# EAGLE design main (EAGLE 5.11)

## Sheet 1 of 5
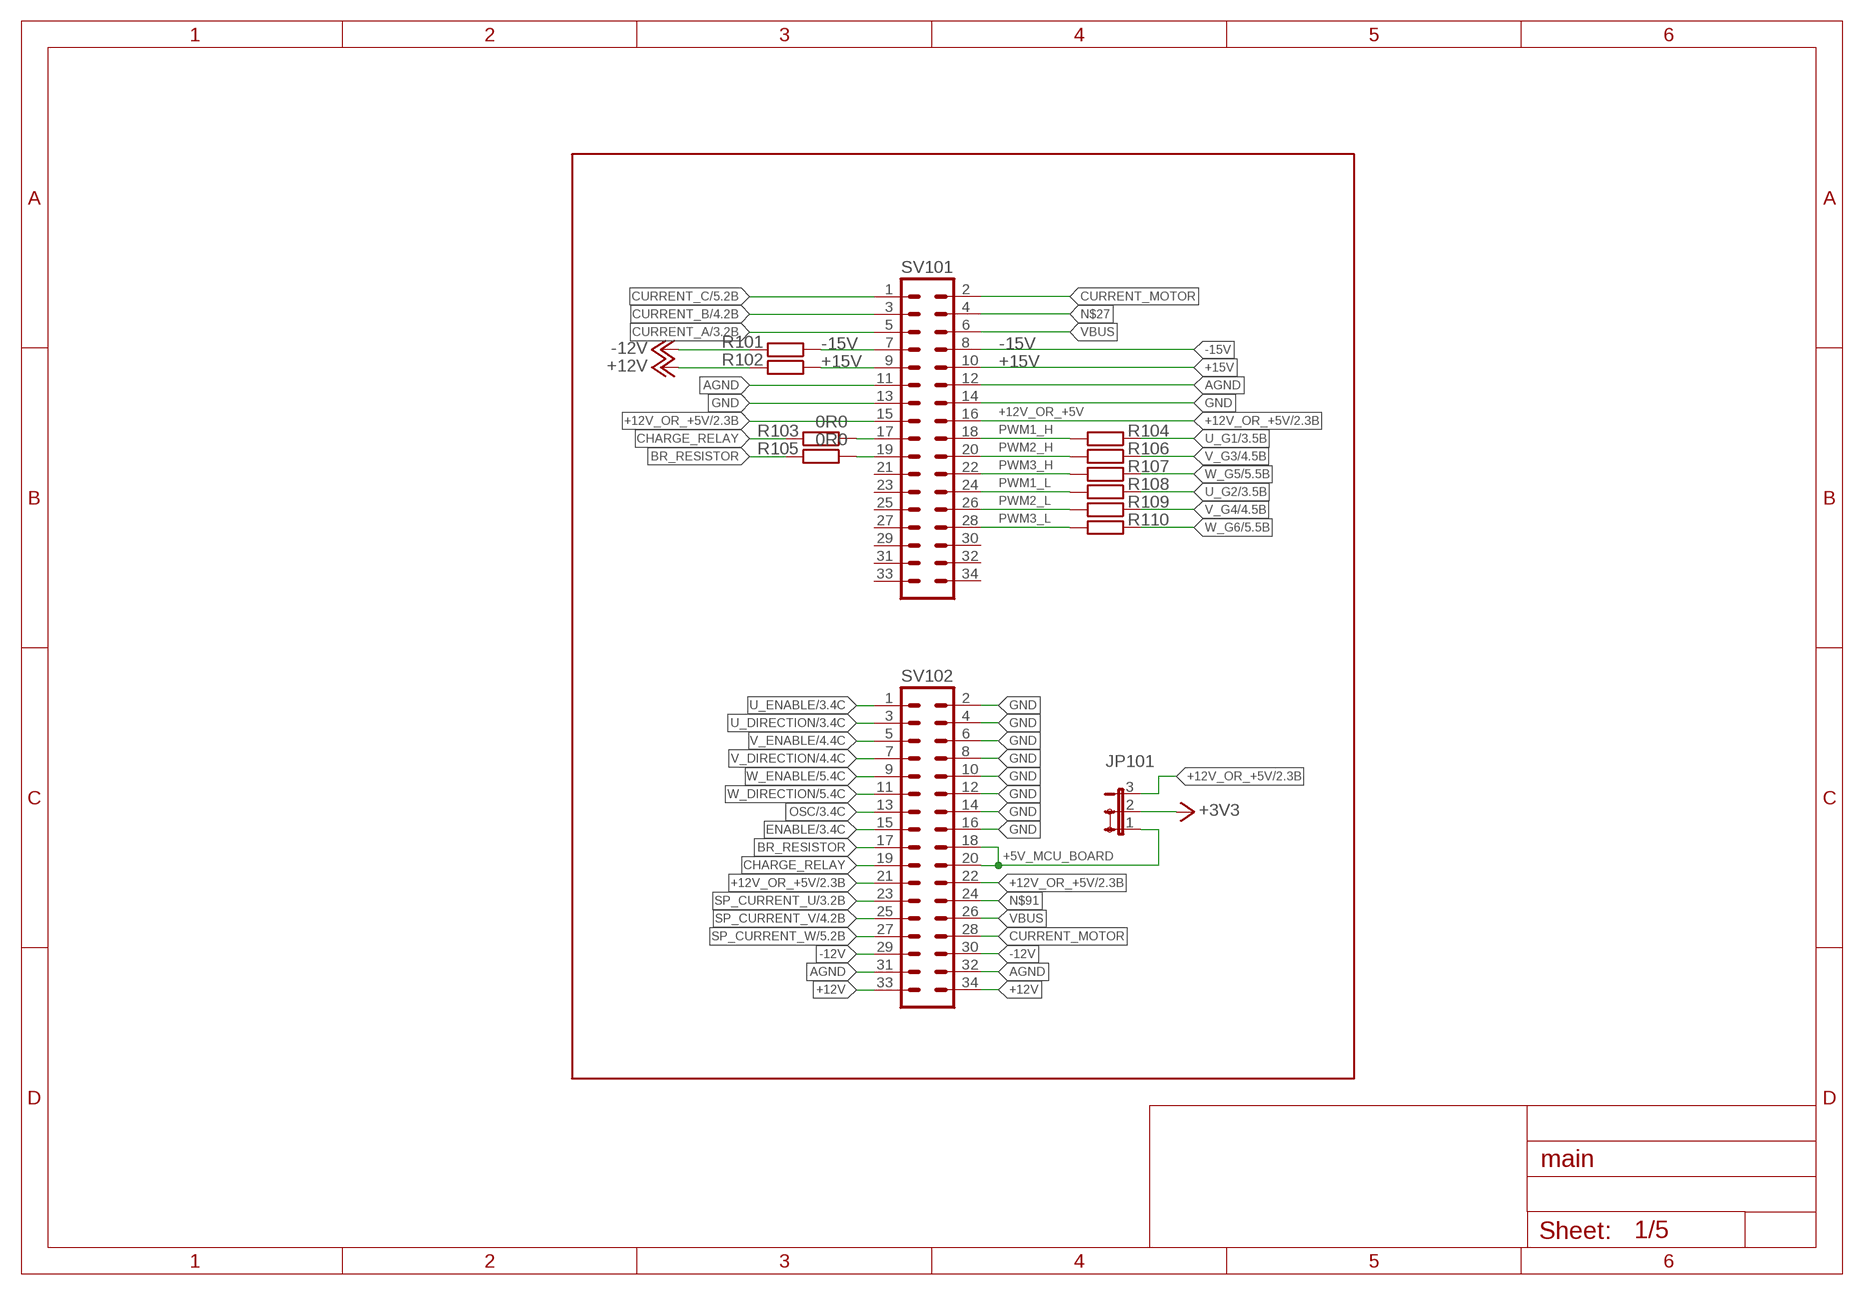
[diagram p0: schematic, sheet 1]

### Parts
JP101  JP2E  [JP2]
R101  R-EU_0204/7  [0204/7]
R102  R-EU_0204/7  [0204/7]
R103  0R0  R-EU_0204/7  [0204/7]
R104  R-EU_0204/7  [0204/7]
R105  0R0  R-EU_0204/7  [0204/7]
R106  R-EU_0204/7  [0204/7]
R107  R-EU_0204/7  [0204/7]
R108  R-EU_0204/7  [0204/7]
R109  R-EU_0204/7  [0204/7]
R110  R-EU_0204/7  [0204/7]
SV101  ML34  [ML34]
SV102  ML34  [ML34]

### Nets
+3V3: JP101.2 ; also sheet 2,3,4,5
+5V_MCU_BOARD: JP101.1 SV102.18 SV102.20
+12V: R102.2 SV102.33 SV102.34 ; also sheet 3,4,5
+12V_OR_+5V: JP101.3 SV101.15 SV101.16 SV102.21 SV102.22 ; also sheet 2
+15V: R102.1 SV101.9 SV101.10
-12V: R101.2 SV102.29 SV102.30 ; also sheet 3,4,5
-15V: R101.1 SV101.7 SV101.8
AGND: SV101.11 SV101.12 SV102.31 SV102.32 ; also sheet 3,4,5
BR_RESISTOR: R105.2 SV102.17
CHARGE_RELAY: R103.2 SV102.19
CURRENT_A: SV101.5 ; also sheet 3
CURRENT_B: SV101.3 ; also sheet 4
CURRENT_C: SV101.1 ; also sheet 5
CURRENT_MOTOR: SV101.2 SV102.28
ENABLE: SV102.15 ; also sheet 3,4,5
GND: SV101.13 SV101.14 SV102.2 SV102.4 SV102.6 SV102.8 SV102.10 SV102.12 SV102.14 SV102.16 ; also sheet 2,3,4,5
N$8: R105.1 SV101.19
N$27: SV101.4
N$41: R103.1 SV101.17
N$91: SV102.24
OSC: SV102.13 ; also sheet 3,4,5
PWM1_H: R104.2 SV101.18
PWM1_L: R108.2 SV101.24
PWM2_H: R106.2 SV101.20
PWM2_L: R109.2 SV101.26
PWM3_H: R107.2 SV101.22
PWM3_L: R110.2 SV101.28
SP_CURRENT_U: SV102.23 ; also sheet 3
SP_CURRENT_V: SV102.25 ; also sheet 4
SP_CURRENT_W: SV102.27 ; also sheet 5
U_DIRECTION: SV102.3 ; also sheet 3
U_ENABLE: SV102.1 ; also sheet 3
U_G1: R104.1 ; also sheet 3
U_G2: R108.1 ; also sheet 3
V_DIRECTION: SV102.7 ; also sheet 4
V_ENABLE: SV102.5 ; also sheet 4
V_G3: R106.1 ; also sheet 4
V_G4: R109.1 ; also sheet 4
VBUS: SV101.6 SV102.26
W_DIRECTION: SV102.11 ; also sheet 5
W_ENABLE: SV102.9 ; also sheet 5
W_G5: R107.1 ; also sheet 5
W_G6: R110.1 ; also sheet 5
Unconnected: SV101.21 SV101.23 SV101.25 SV101.27 SV101.29 SV101.30 SV101.31 SV101.32 SV101.33 SV101.34

## Sheet 2 of 5
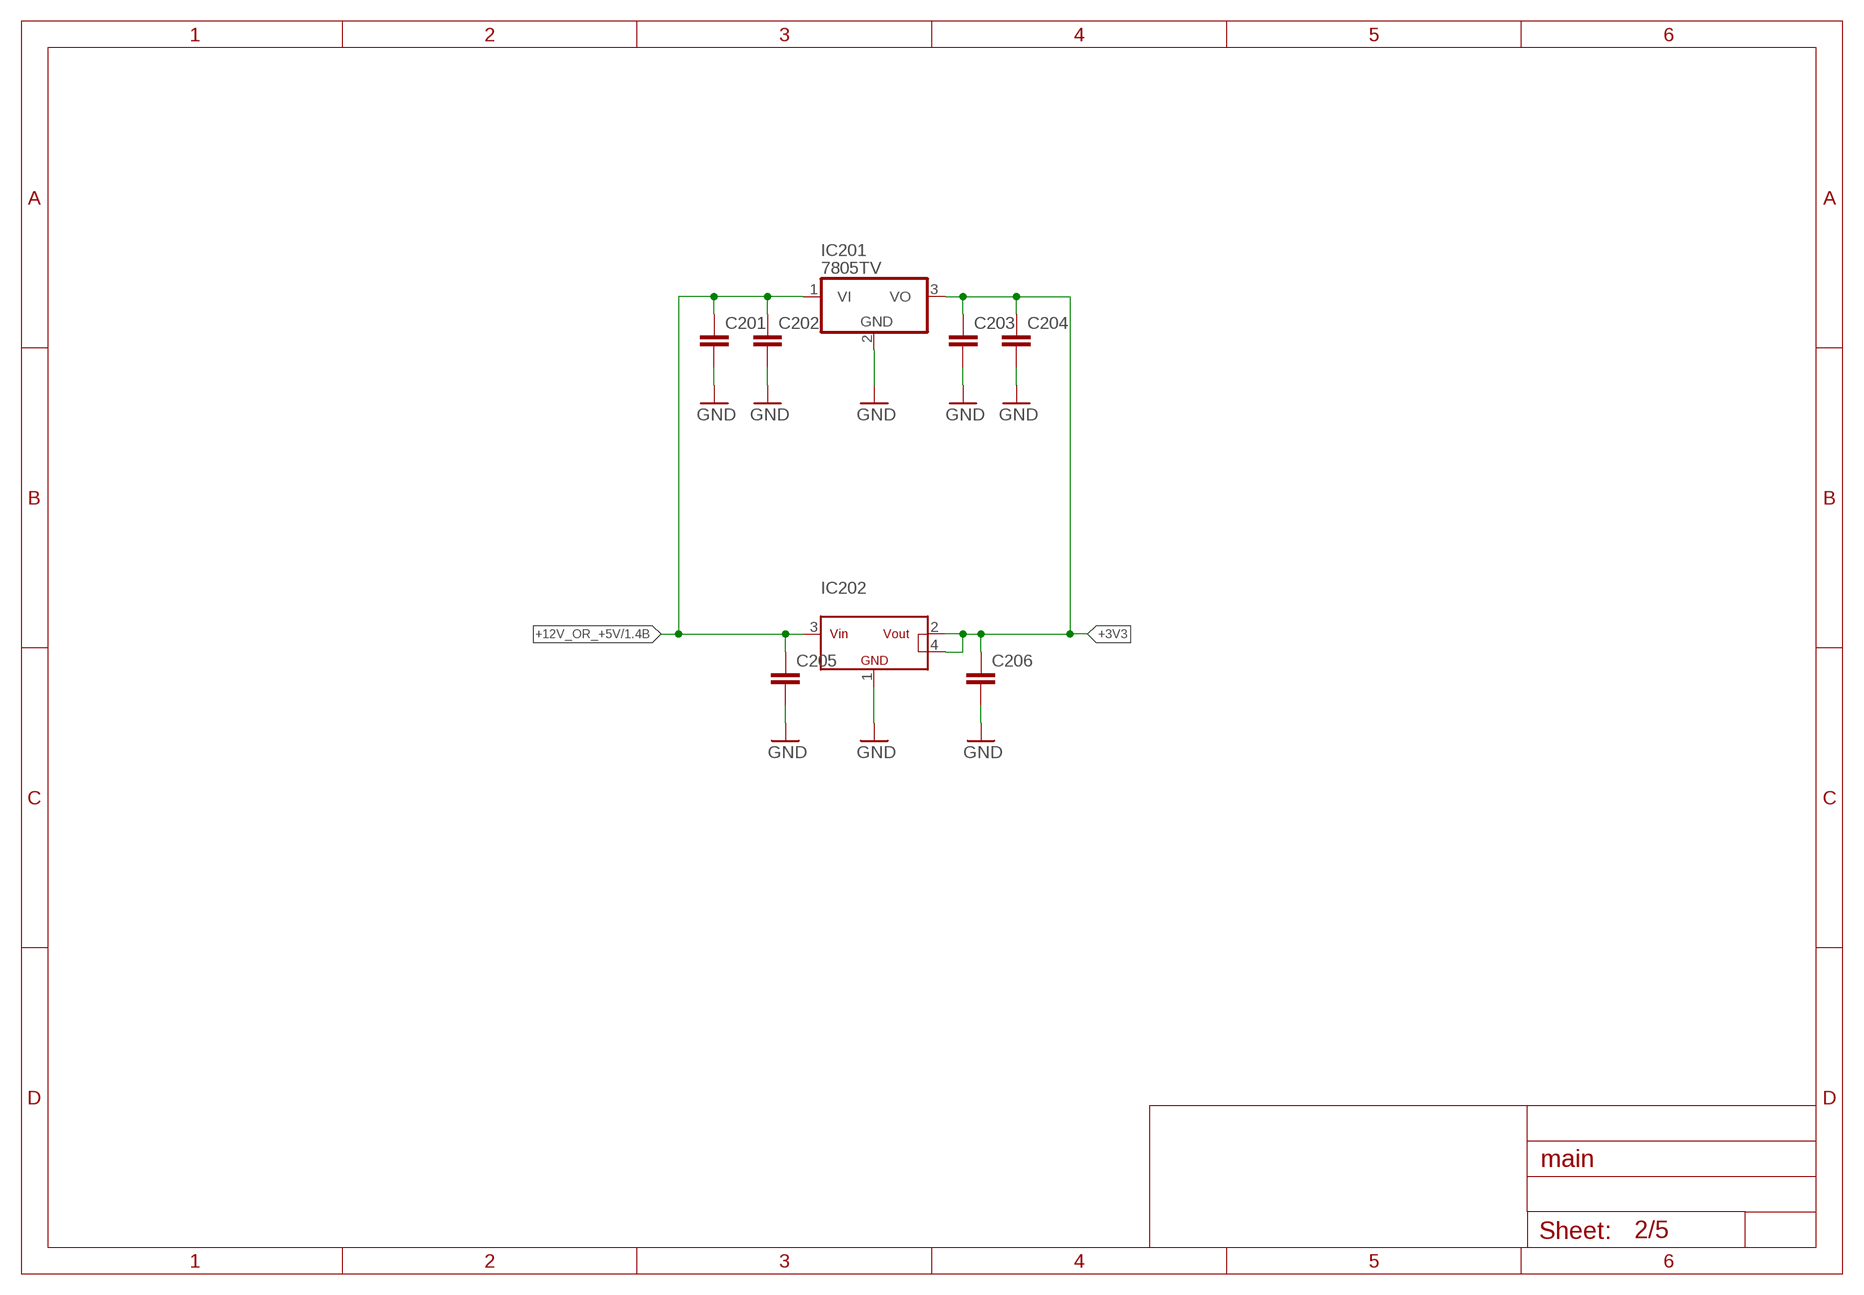
[diagram p1: schematic, sheet 2]

### Parts
C201  C-EUC1206  [C1206]
C202  C-EUC1206  [C1206]
C203  C-EUC1206  [C1206]
C204  C-EUC1206  [C1206]
C205  C-EUC1206  [C1206]
C206  C-EUC1206  [C1206]
IC201  7805TV  [TO220V]
IC202  LM317_SOT223  [SOT223]

### Nets
+3V3: C203.1 C204.1 C206.1 IC201.3(VO) IC202.2 IC202.4(TAB) ; also sheet 1,3,4,5
+12V_OR_+5V: C201.1 C202.1 C205.1 IC201.1(VI) IC202.3 ; also sheet 1
GND: C201.2 C202.2 C203.2 C204.2 C205.2 C206.2 IC201.2(GND) IC202.1 ; also sheet 1,3,4,5

## Sheet 3 of 5
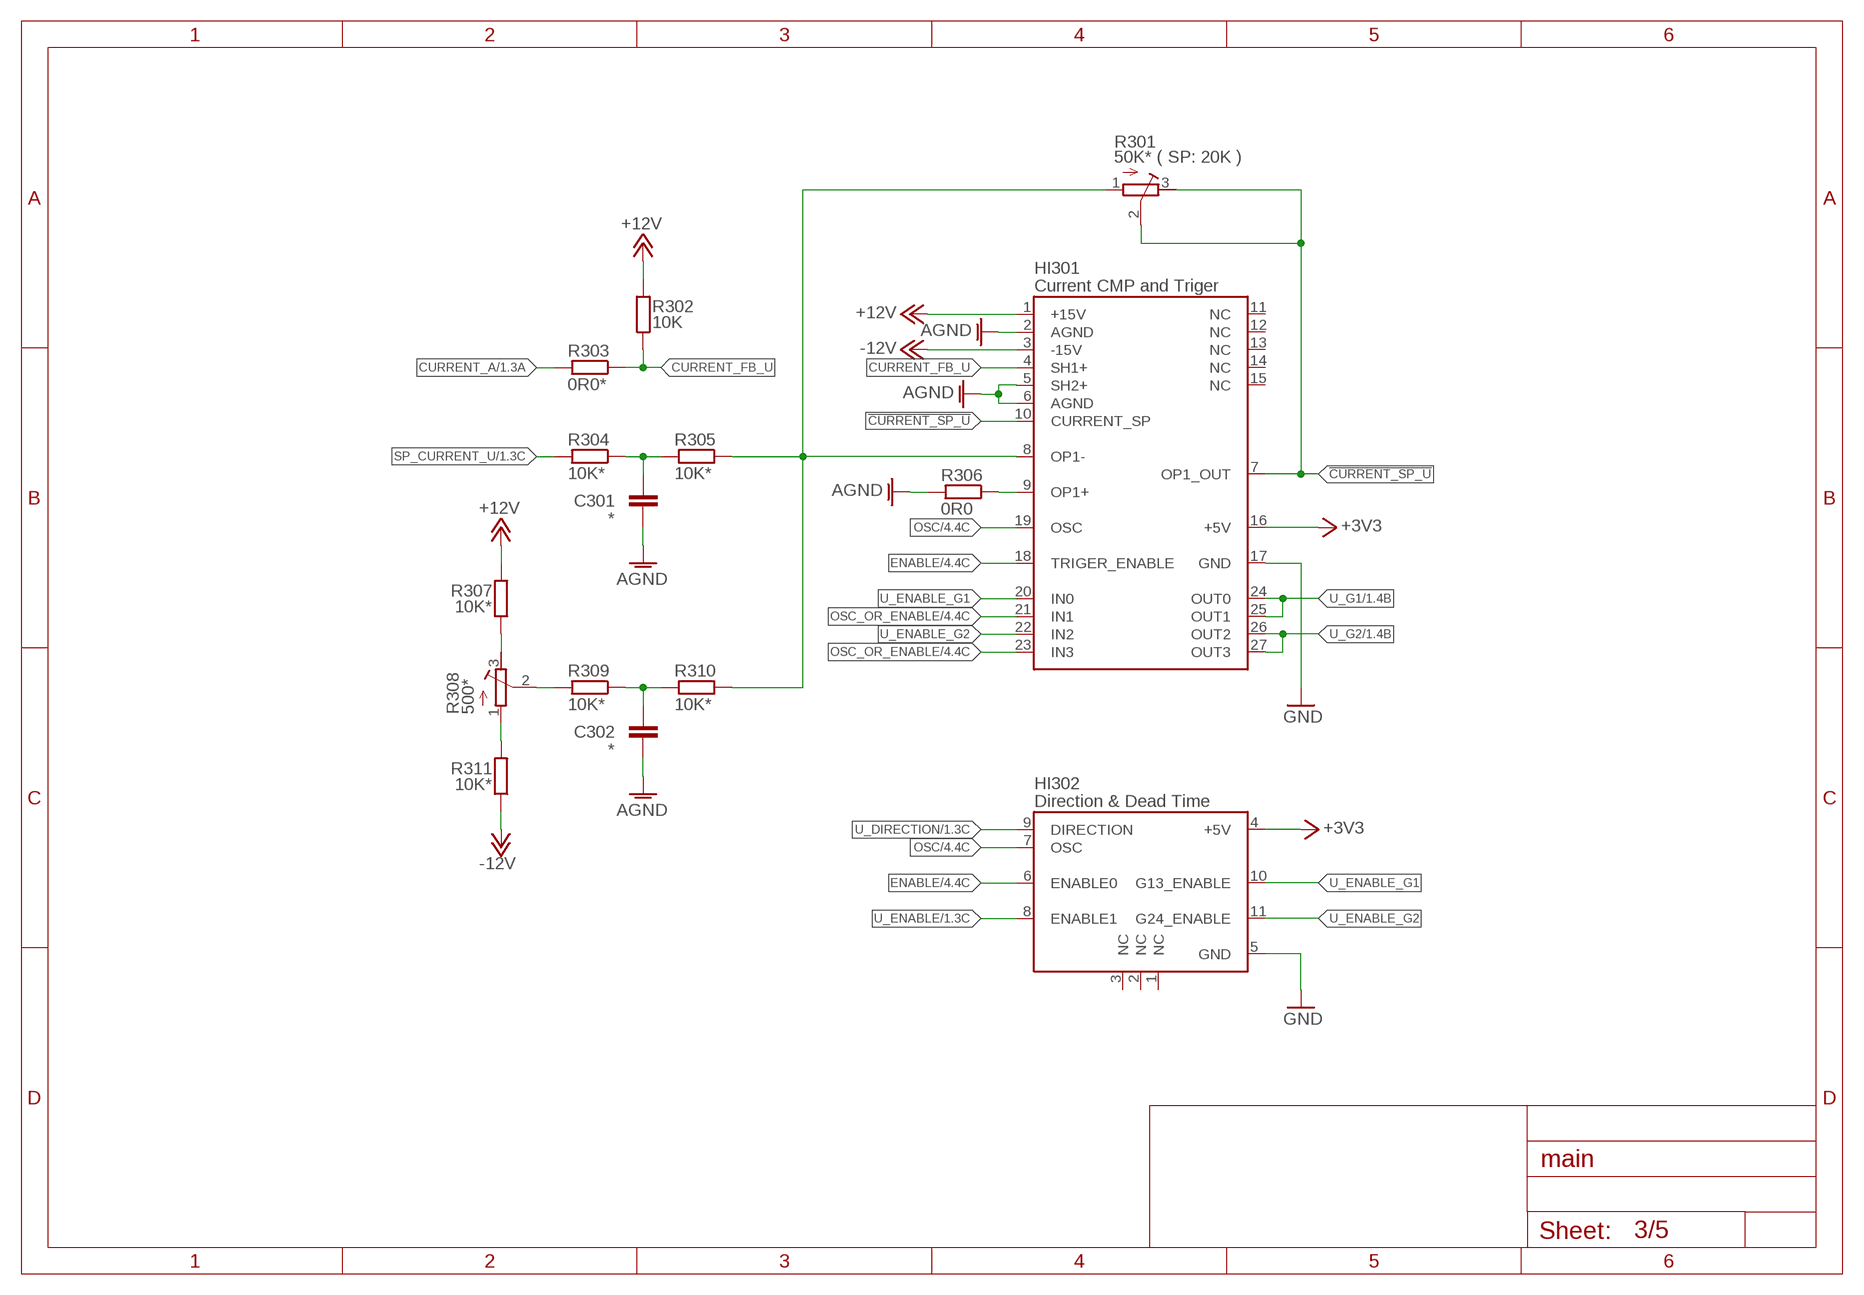
[diagram p2: schematic, sheet 3]

### Parts
C301  *  C-EU050-030X075  [C050-030X075]
C302  *  C-EU050-030X075  [C050-030X075]
HI301  Current CMP and Triger  19.05.15  [19.06.15_H]
HI302  Direction & Dead Time  19.05.15  [19.06.15_H]
R301  50K* ( SP: 20K )  R-TRIMM3296W  [RTRIM3296W]
R302  10K  R-EU_0204/7  [0204/7]
R303  0R0*  R-EU_0204/7  [0204/7]
R304  10K*  R-EU_0204/7  [0204/7]
R305  10K*  R-EU_0204/7  [0204/7]
R306  0R0  R-EU_0204/7  [0204/7]
R307  10K*  R-EU_0204/7  [0204/7]
R308  500*  R-TRIMM3296W  [RTRIM3296W]
R309  10K*  R-EU_0204/7  [0204/7]
R310  10K*  R-EU_0204/7  [0204/7]
R311  10K*  R-EU_0204/7  [0204/7]

### Nets
!CURRENT_SP_U: HI301.7(OP1_OUT) HI301.10(CURRENT_SP) R301.2(S) R301.3(A)
+3V3: HI301.16(+5V) HI302.4(+5V) ; also sheet 1,2,4,5
+12V: HI301.1(+15V) R302.2 R307.2 ; also sheet 1,4,5
-12V: HI301.3(-15V) R311.1 ; also sheet 1,4,5
AGND: C301.2 C302.2 HI301.2(AGND) HI301.5(SH2+) HI301.6(AGND) R306.2 ; also sheet 1,4,5
CURRENT_A: R303.2 ; also sheet 1
CURRENT_FB_U: HI301.4(SH1+) R302.1 R303.1
ENABLE: HI301.18(TRIGER_ENABLE) HI302.6(ENABLE0) ; also sheet 1,4,5
GND: HI301.17(GND) HI302.5(GND) ; also sheet 1,2,4,5
N$55: HI301.8(OP1-) R301.1(E) R305.1 R310.1
N$56: C301.1 R304.1 R305.2
N$57: HI301.9(OP1+) R306.1
N$58: C302.1 R309.1 R310.2
N$59: R308.2(S) R309.2
N$60: R307.1 R308.3(A)
N$61: R308.1(E) R311.2
OSC: HI301.19(OSC) HI302.7(OSC) ; also sheet 1,4,5
OSC_OR_ENABLE: HI301.21(IN1) HI301.23(IN3) ; also sheet 4,5
SP_CURRENT_U: R304.2 ; also sheet 1
U_DIRECTION: HI302.9(DIRECTION) ; also sheet 1
U_ENABLE: HI302.8(ENABLE1) ; also sheet 1
U_ENABLE_G1: HI301.20(IN0) HI302.10(G13_ENABLE)
U_ENABLE_G2: HI301.22(IN2) HI302.11(G24_ENABLE)
U_G1: HI301.24(OUT0) HI301.25(OUT1) ; also sheet 1
U_G2: HI301.26(OUT2) HI301.27(OUT3) ; also sheet 1
Unconnected: HI301.11(NC) HI301.12(NC) HI301.13(NC) HI301.14(NC) HI301.15(NC) HI302.1(NC) HI302.2(NC) HI302.3(NC)

## Sheet 4 of 5
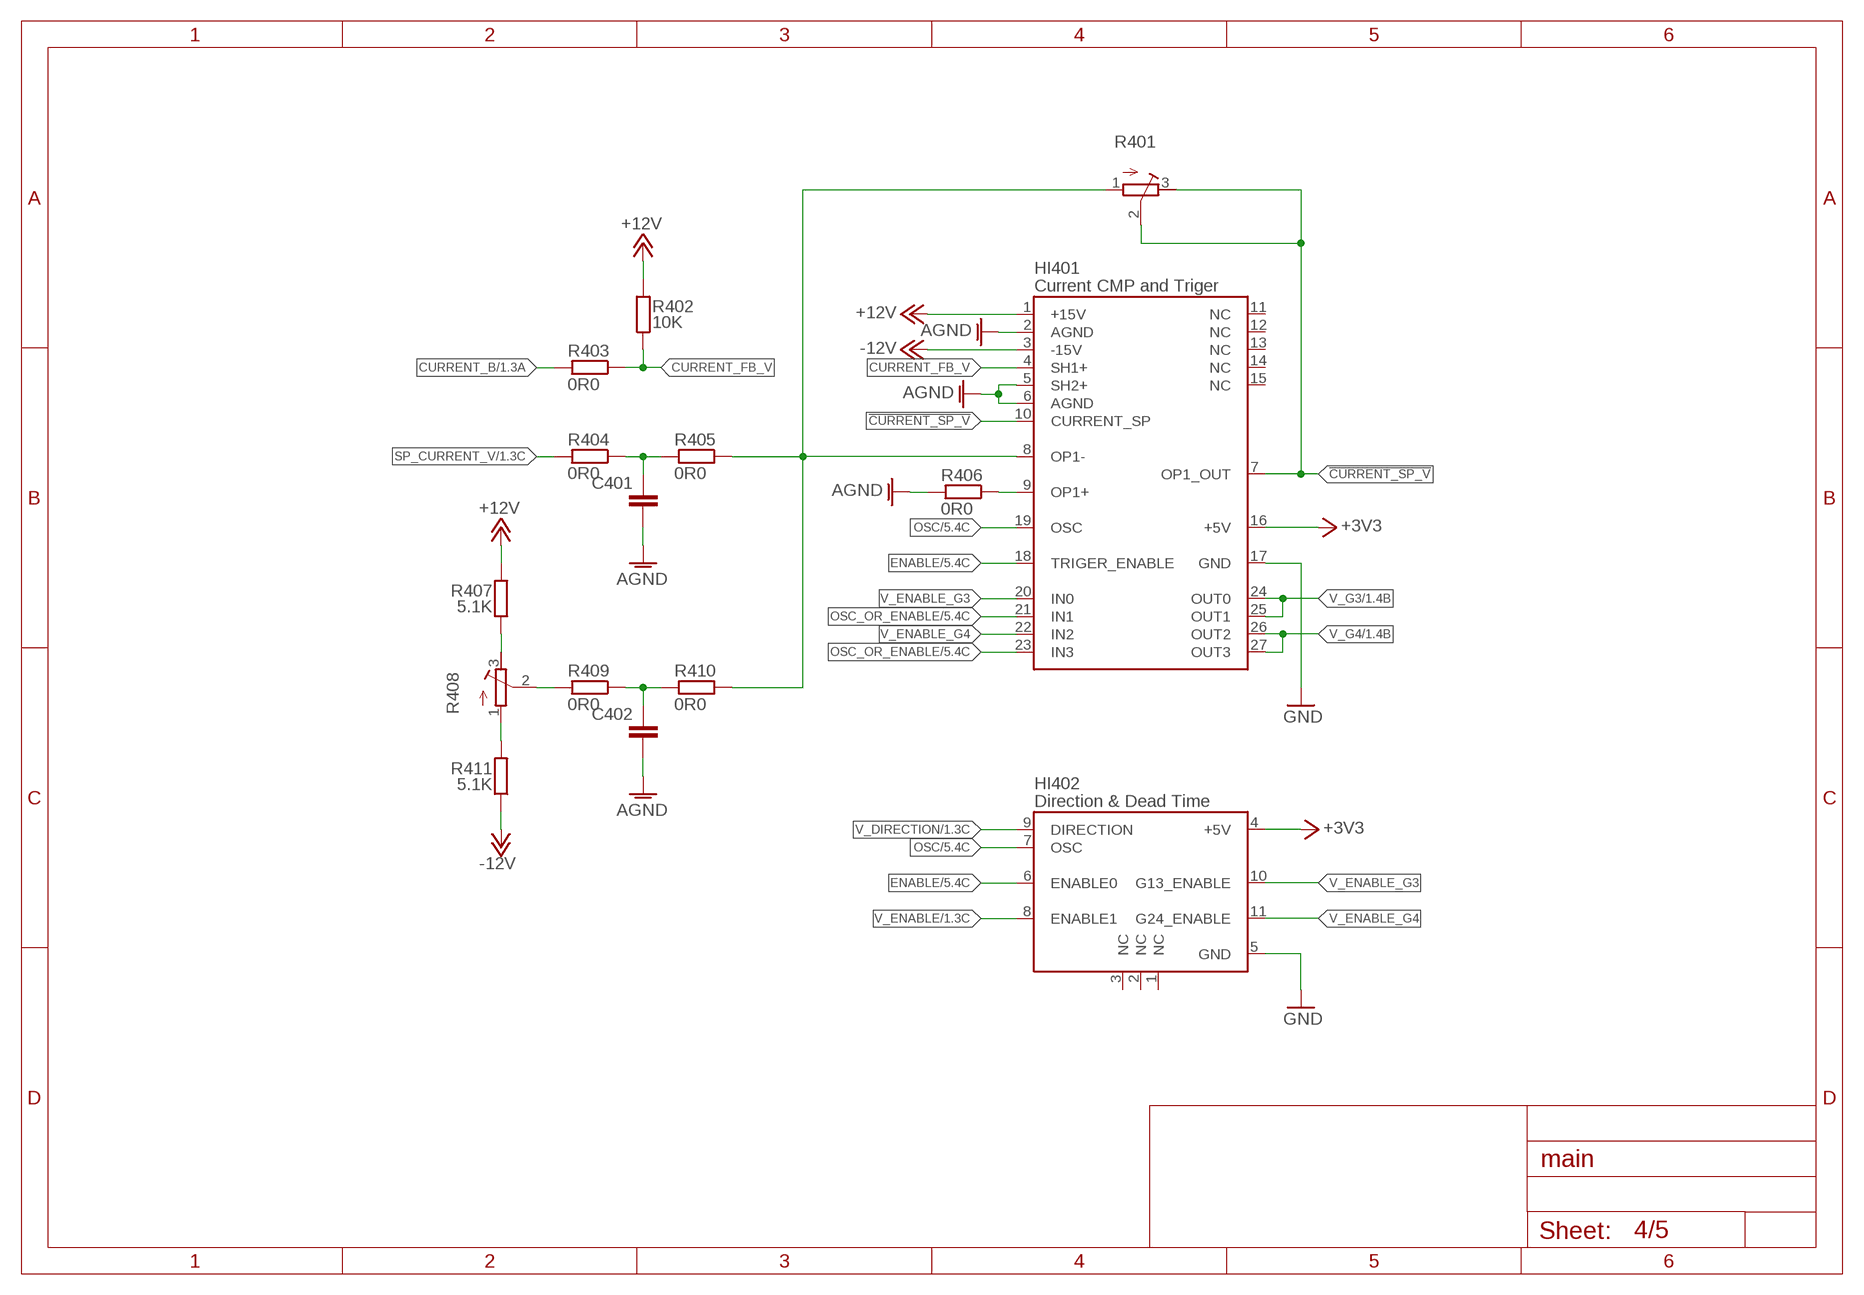
[diagram p3: schematic, sheet 4]

### Parts
C401  C-EU050-030X075  [C050-030X075]
C402  C-EU050-030X075  [C050-030X075]
HI401  Current CMP and Triger  19.05.15  [19.06.15_H]
HI402  Direction & Dead Time  19.05.15  [19.06.15_H]
R401  R-TRIMM3296W  [RTRIM3296W]
R402  10K  R-EU_0204/7  [0204/7]
R403  0R0  R-EU_0204/7  [0204/7]
R404  0R0  R-EU_0204/7  [0204/7]
R405  0R0  R-EU_0204/7  [0204/7]
R406  0R0  R-EU_0204/7  [0204/7]
R407  5.1K  R-EU_0204/7  [0204/7]
R408  R-TRIMM3296W  [RTRIM3296W]
R409  0R0  R-EU_0204/7  [0204/7]
R410  0R0  R-EU_0204/7  [0204/7]
R411  5.1K  R-EU_0204/7  [0204/7]

### Nets
!CURRENT_SP_V: HI401.7(OP1_OUT) HI401.10(CURRENT_SP) R401.2(S) R401.3(A)
+3V3: HI401.16(+5V) HI402.4(+5V) ; also sheet 1,2,3,5
+12V: HI401.1(+15V) R402.2 R407.2 ; also sheet 1,3,5
-12V: HI401.3(-15V) R411.1 ; also sheet 1,3,5
AGND: C401.2 C402.2 HI401.2(AGND) HI401.5(SH2+) HI401.6(AGND) R406.2 ; also sheet 1,3,5
CURRENT_B: R403.2 ; also sheet 1
CURRENT_FB_V: HI401.4(SH1+) R402.1 R403.1
ENABLE: HI401.18(TRIGER_ENABLE) HI402.6(ENABLE0) ; also sheet 1,3,5
GND: HI401.17(GND) HI402.5(GND) ; also sheet 1,2,3,5
N$62: HI401.8(OP1-) R401.1(E) R405.1 R410.1
N$63: C401.1 R404.1 R405.2
N$64: HI401.9(OP1+) R406.1
N$65: C402.1 R409.1 R410.2
N$66: R408.2(S) R409.2
N$67: R407.1 R408.3(A)
N$68: R408.1(E) R411.2
OSC: HI401.19(OSC) HI402.7(OSC) ; also sheet 1,3,5
OSC_OR_ENABLE: HI401.21(IN1) HI401.23(IN3) ; also sheet 3,5
SP_CURRENT_V: R404.2 ; also sheet 1
V_DIRECTION: HI402.9(DIRECTION) ; also sheet 1
V_ENABLE: HI402.8(ENABLE1) ; also sheet 1
V_ENABLE_G3: HI401.20(IN0) HI402.10(G13_ENABLE)
V_ENABLE_G4: HI401.22(IN2) HI402.11(G24_ENABLE)
V_G3: HI401.24(OUT0) HI401.25(OUT1) ; also sheet 1
V_G4: HI401.26(OUT2) HI401.27(OUT3) ; also sheet 1
Unconnected: HI401.11(NC) HI401.12(NC) HI401.13(NC) HI401.14(NC) HI401.15(NC) HI402.1(NC) HI402.2(NC) HI402.3(NC)

## Sheet 5 of 5
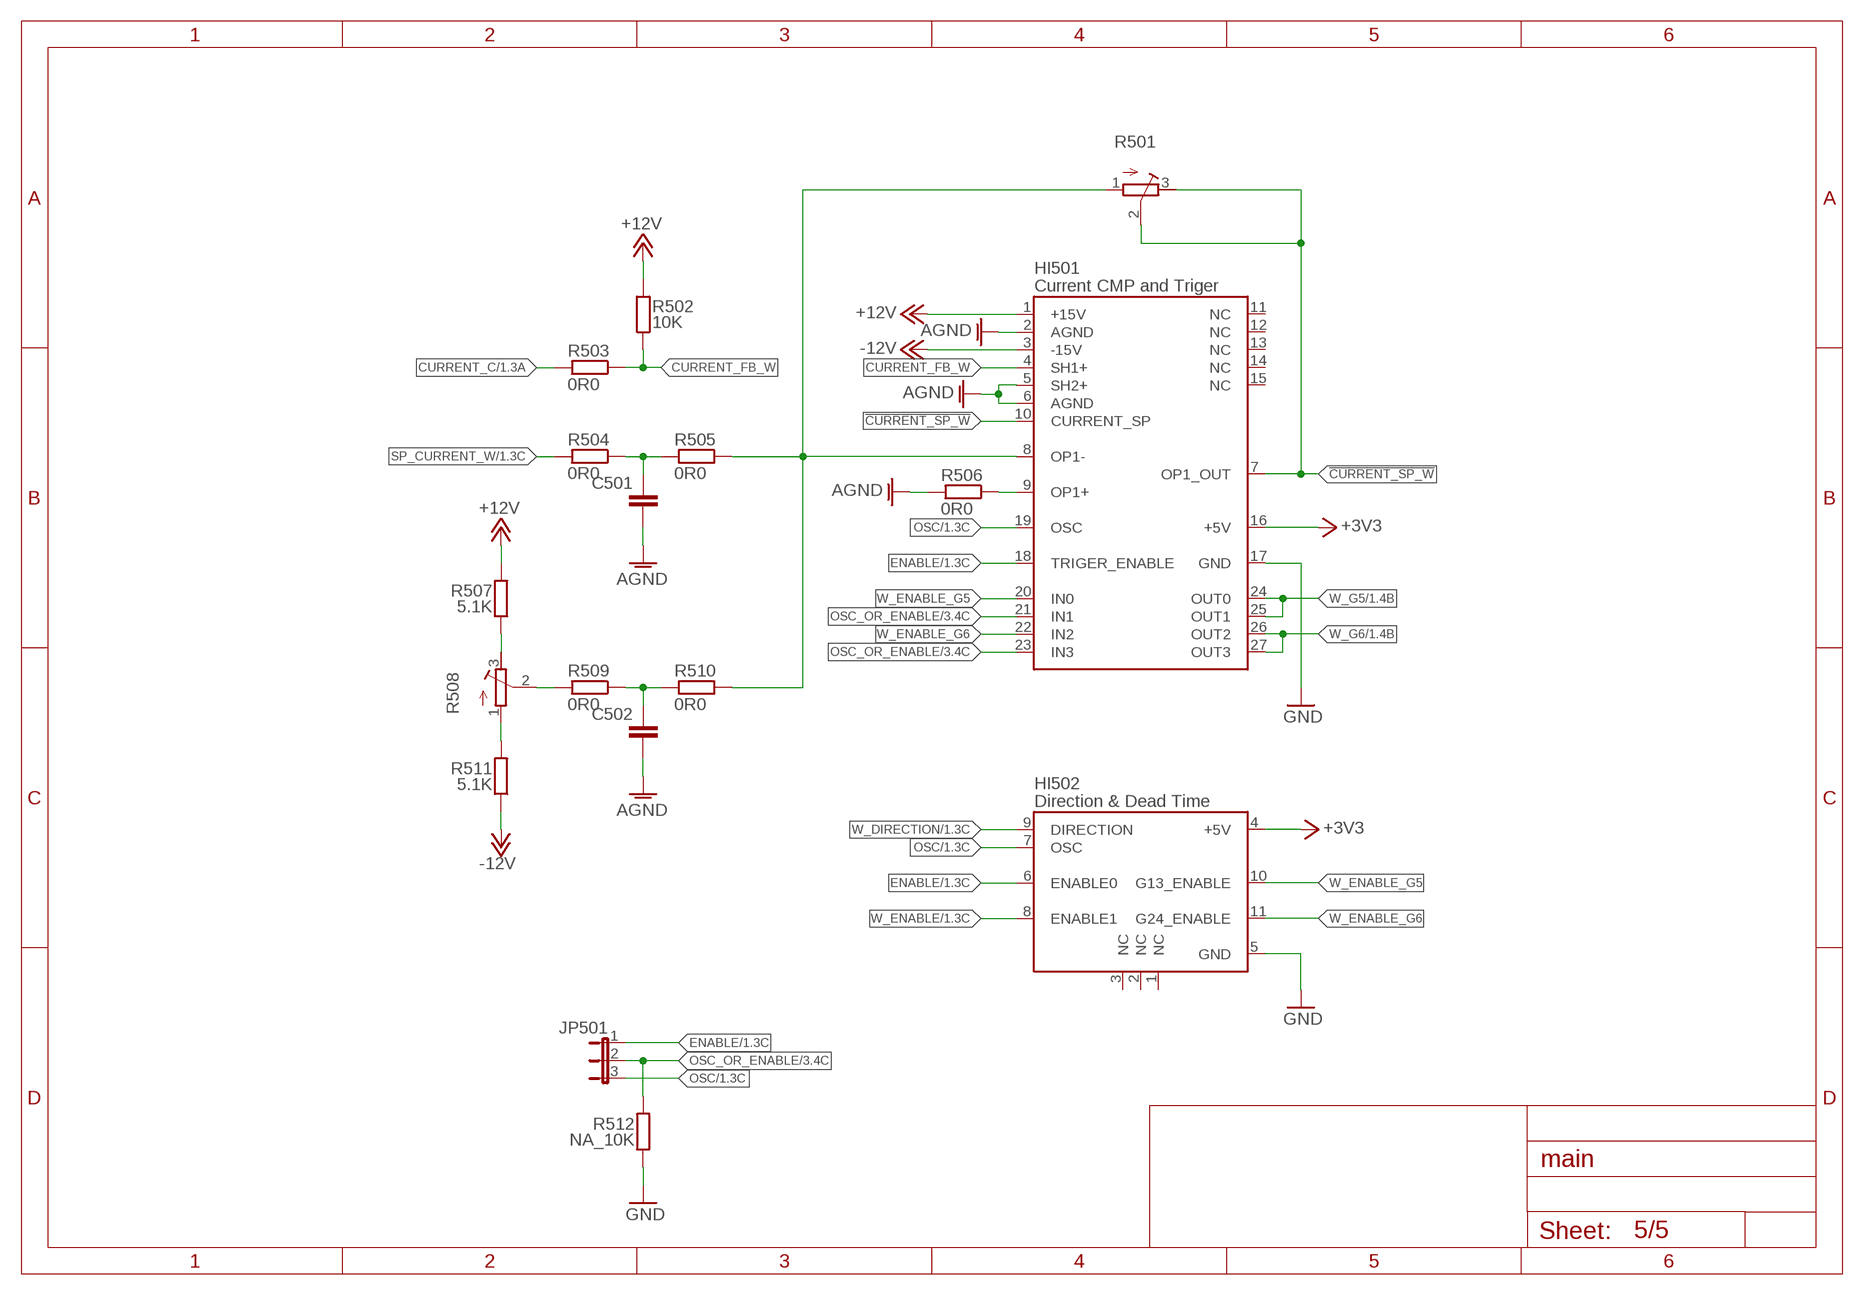
[diagram p4: schematic, sheet 5]

### Parts
C501  C-EU050-030X075  [C050-030X075]
C502  C-EU050-030X075  [C050-030X075]
HI501  Current CMP and Triger  19.05.15  [19.06.15_H]
HI502  Direction & Dead Time  19.05.15  [19.06.15_H]
JP501  JP2E  [JP2]
R501  R-TRIMM3296W  [RTRIM3296W]
R502  10K  R-EU_0204/7  [0204/7]
R503  0R0  R-EU_0204/7  [0204/7]
R504  0R0  R-EU_0204/7  [0204/7]
R505  0R0  R-EU_0204/7  [0204/7]
R506  0R0  R-EU_0204/7  [0204/7]
R507  5.1K  R-EU_0204/7  [0204/7]
R508  R-TRIMM3296W  [RTRIM3296W]
R509  0R0  R-EU_0204/7  [0204/7]
R510  0R0  R-EU_0204/7  [0204/7]
R511  5.1K  R-EU_0204/7  [0204/7]
R512  NA_10K  R-EU_0204/7  [0204/7]

### Nets
!CURRENT_SP_W: HI501.7(OP1_OUT) HI501.10(CURRENT_SP) R501.2(S) R501.3(A)
+3V3: HI501.16(+5V) HI502.4(+5V) ; also sheet 1,2,3,4
+12V: HI501.1(+15V) R502.2 R507.2 ; also sheet 1,3,4
-12V: HI501.3(-15V) R511.1 ; also sheet 1,3,4
AGND: C501.2 C502.2 HI501.2(AGND) HI501.5(SH2+) HI501.6(AGND) R506.2 ; also sheet 1,3,4
CURRENT_C: R503.2 ; also sheet 1
CURRENT_FB_W: HI501.4(SH1+) R502.1 R503.1
ENABLE: HI501.18(TRIGER_ENABLE) HI502.6(ENABLE0) JP501.1 ; also sheet 1,3,4
GND: HI501.17(GND) HI502.5(GND) R512.1 ; also sheet 1,2,3,4
N$69: HI501.8(OP1-) R501.1(E) R505.1 R510.1
N$70: C501.1 R504.1 R505.2
N$71: HI501.9(OP1+) R506.1
N$72: C502.1 R509.1 R510.2
N$73: R508.2(S) R509.2
N$74: R507.1 R508.3(A)
N$75: R508.1(E) R511.2
OSC: HI501.19(OSC) HI502.7(OSC) JP501.3 ; also sheet 1,3,4
OSC_OR_ENABLE: HI501.21(IN1) HI501.23(IN3) JP501.2 R512.2 ; also sheet 3,4
SP_CURRENT_W: R504.2 ; also sheet 1
W_DIRECTION: HI502.9(DIRECTION) ; also sheet 1
W_ENABLE: HI502.8(ENABLE1) ; also sheet 1
W_ENABLE_G5: HI501.20(IN0) HI502.10(G13_ENABLE)
W_ENABLE_G6: HI501.22(IN2) HI502.11(G24_ENABLE)
W_G5: HI501.24(OUT0) HI501.25(OUT1) ; also sheet 1
W_G6: HI501.26(OUT2) HI501.27(OUT3) ; also sheet 1
Unconnected: HI501.11(NC) HI501.12(NC) HI501.13(NC) HI501.14(NC) HI501.15(NC) HI502.1(NC) HI502.2(NC) HI502.3(NC)

## Library data of the parts
C201-C206 C301 C302 C401 C402 C501 C502 = rcl:C-EU: CAPACITOR, European symbol
HI301 HI401 HI501 = Current PWM:19.05.15
HI302 HI402 HI502 = Dead Time:19.05.15
IC201 = linear:78*: Positive VOLTAGE REGULATOR Source: http://cache.national.com/ds/LM/LM78L05.pdf http://www.fairchildsemi.com/ds/LM/LM7805.pdf
IC202 = linear:LM317_SOT223
JP101 JP501 = jumper:JP2E: JUMPER
R101-R110 R302-R307 R309-R311 R402-R407 R409-R411 R502-R507 R509-R512 = rcl:R-EU_: RESISTOR, European symbol
R301 R308 R401 R408 R501 R508 = rcl:R-TRIMM: Trimm resistor
SV101 SV102 = con-harting-ml:ML34: HARTING; OC_FARNELL: unknown; OC_NEWARK: unknown

## Board
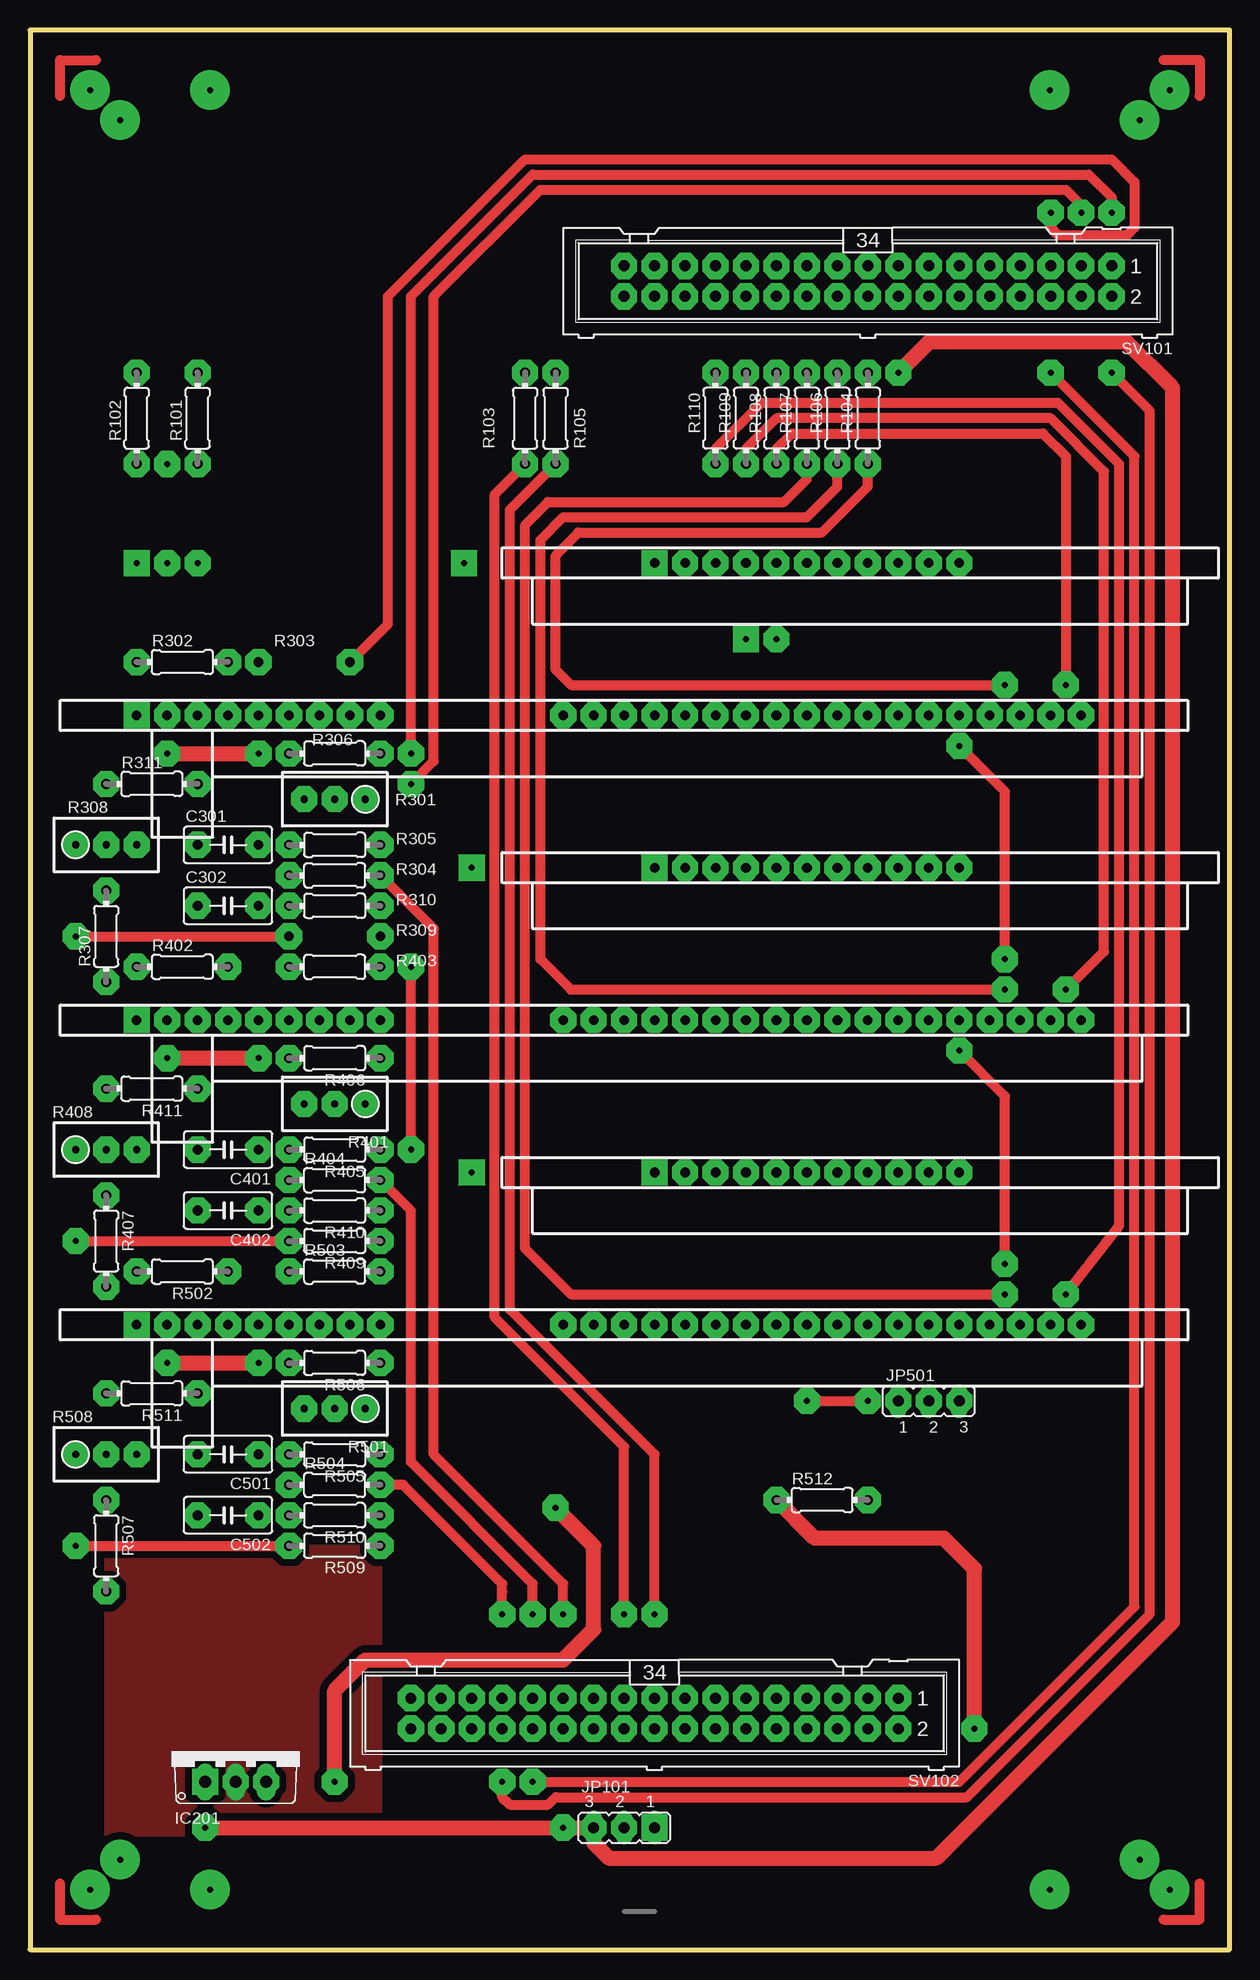
[diagram p5: board, top side]
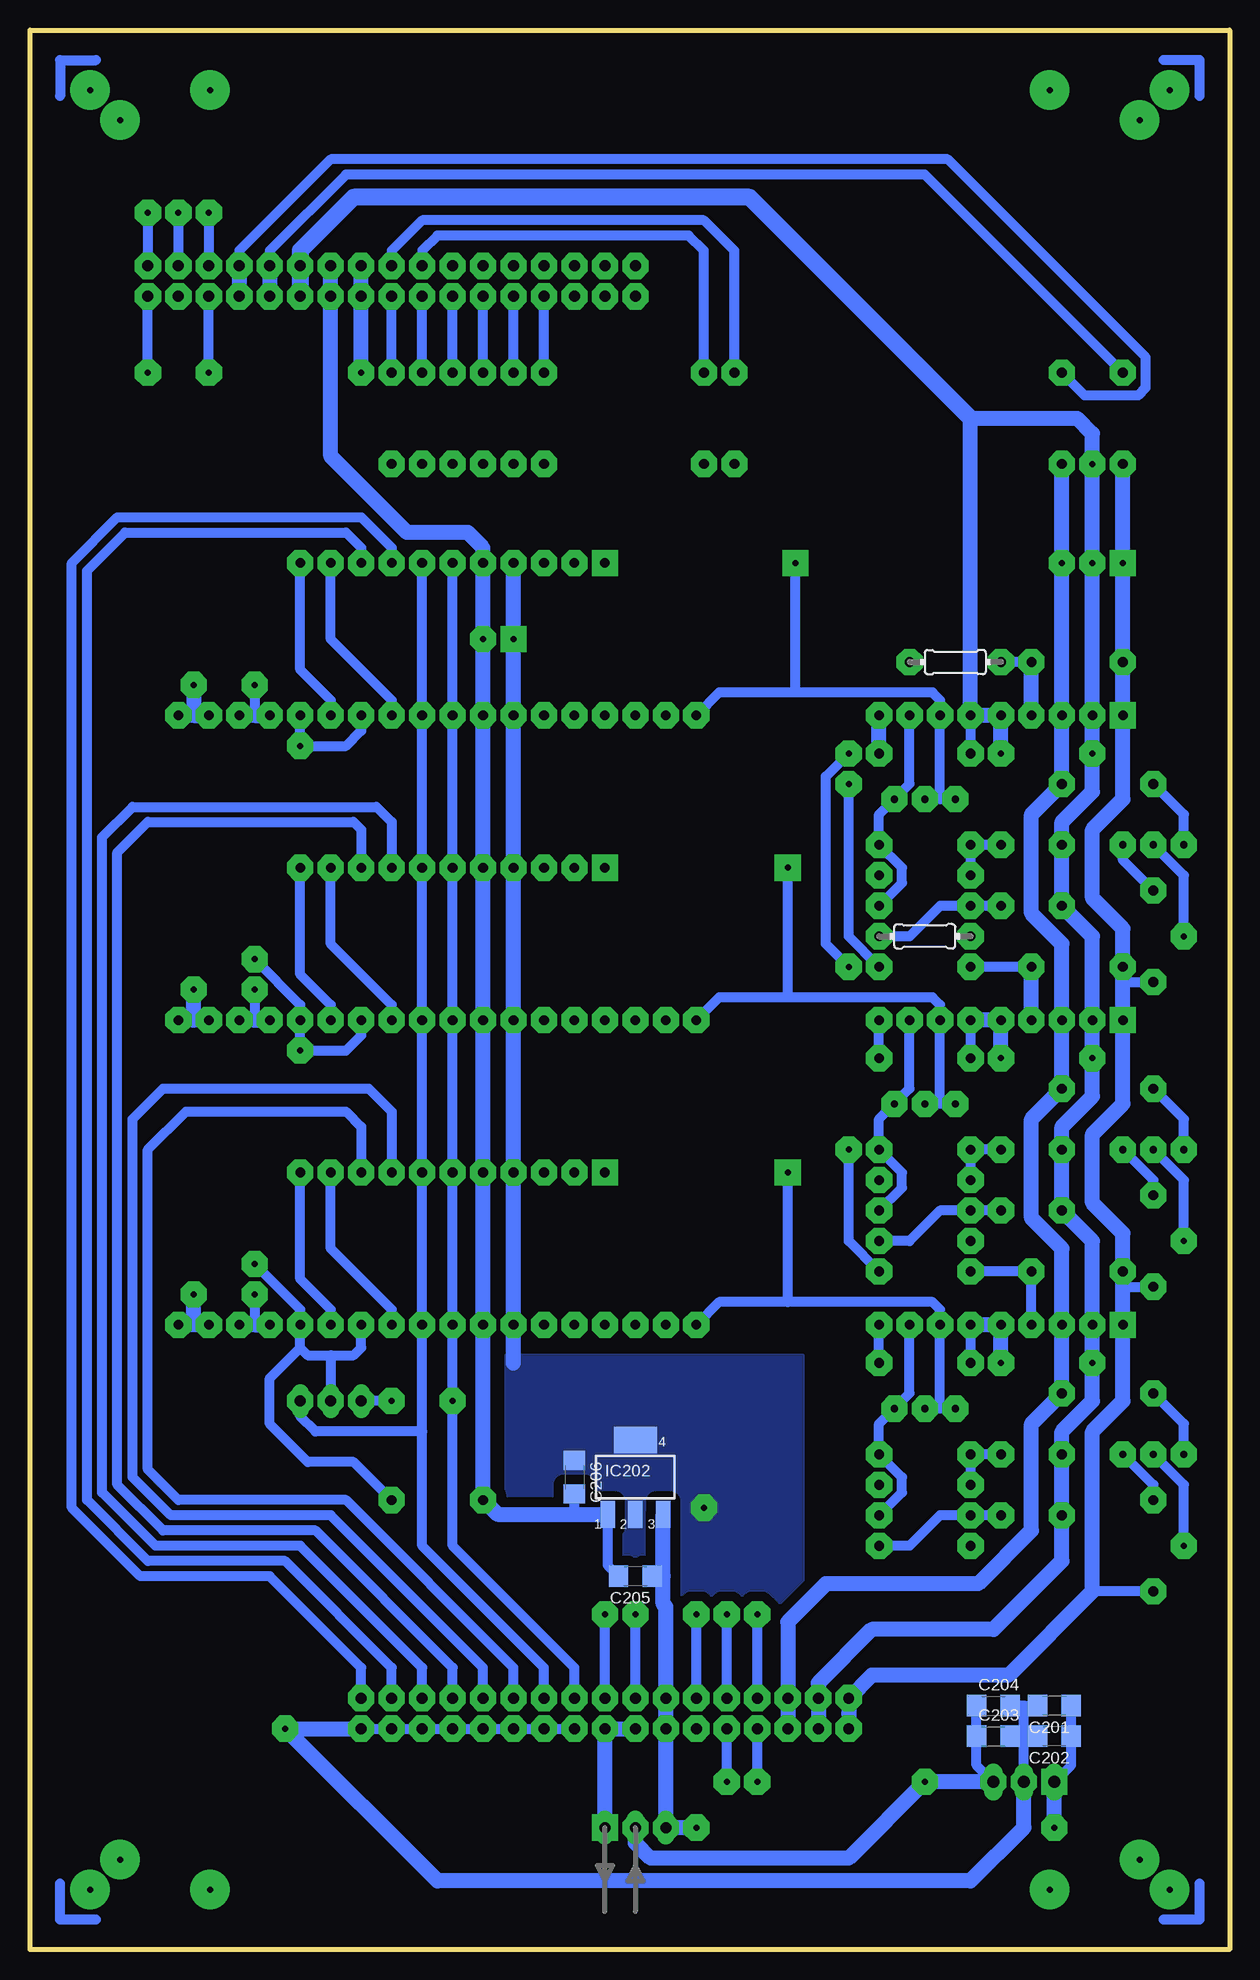
[diagram p6: board, bottom side, seen from below]

Size 100 x 160 mm. Coordinates in mm from the lower left corner, seen from the top.
Outline: 0,0 100,0 100,160 0,160 0,0
Copper layers (1*16): Top 0.035mm / dielectric 1.5mm / Bottom 0.035mm
Design rules "default": minimum track width 10mil, minimum drill 24mil, track to track 8mil, track to pad 8mil, pad to pad 8mil, via to via 8mil, smd to smd 8mil, copper to edge 40mil, drill to drill 8mil, minimum pad ring 10mil, minimum via ring 8mil, stop-mask expansion 4mil, vias tented up to drill 0mil, thermal gap 10mil

### Footprints (pad centres in the part's own frame; a part is rotated, then mirrored left to right if it is on the bottom)
C1206 = smd 1.6 x 1.8: 1 -1.4,0; 2 1.4,0
C050-030X075 = drill 0.813 octagon: 1 -2.54,0; 2 2.54,0
19.06.15_H = drill 0.8 square: 1 0,0 | drill 0.8 octagon: 2 2.54,0; 3 5.08,0; 4 7.62,0; 5 10.16,0; 6 12.7,0; 7 15.24,0; 8 17.78,0; 9 20.32,0; 10 35.56,0; 11 38.1,0; 12 40.64,0; 13 43.18,0; 14 45.72,0; 15 48.26,0; 16 50.8,0; 17 53.34,0; 18 55.88,0; 19 58.42,0; 20 60.96,0; 21 63.5,0; 22 66.04,0; 23 68.58,0; 24 71.12,0; 25 73.66,0; 26 76.2,0; 27 78.74,0
19.06.15_H' = drill 0.8 square: 1 0,0 | drill 0.8 octagon: 2 2.54,0; 3 5.08,0; 4 7.62,0; 5 10.16,0; 6 12.7,0; 7 15.24,0; 8 17.78,0; 9 20.32,0; 10 22.86,0; 11 25.4,0
TO220V = drill 1.016 long: 1 -2.54,-2.54; 2 0,-2.54; 3 2.54,-2.54
SOT223 = smd 1.219 x 2.235: 1 -2.311,-3.099; 2 0,-3.099; 3 2.311,-3.099 | smd 3.6 x 2.2: 4 0,3.099
JP2 = drill 0.914 long: 1 -2.54,0; 2 0,0; 3 2.54,0
0204/7 = drill 0.813 octagon: 1 -3.81,0; 2 3.81,0
RTRIM3296W = drill 0.61 round: 1 0,-2.54; 2 0,0; 3 0,2.54
ML34 = drill 0.914 octagon: 1 -20.32,-1.27; 2 -20.32,1.27; 3 -17.78,-1.27; 4 -17.78,1.27; 5 -15.24,-1.27; 6 -15.24,1.27; 7 -12.7,-1.27; 8 -12.7,1.27; 9 -10.16,-1.27; 10 -10.16,1.27; 11 -7.62,-1.27; 12 -7.62,1.27; 13 -5.08,-1.27; 14 -5.08,1.27; 15 -2.54,-1.27; 16 -2.54,1.27; 17 0,-1.27; 18 0,1.27; 19 2.54,-1.27; 20 2.54,1.27; 21 5.08,-1.27; 22 5.08,1.27; 23 7.62,-1.27; 24 7.62,1.27; 25 10.16,-1.27; 26 10.16,1.27; 27 12.7,-1.27; 28 12.7,1.27; 29 15.24,-1.27; 30 15.24,1.27; 31 17.78,-1.27; 32 17.78,1.27; 33 20.32,-1.27; 34 20.32,1.27

### Placement (x,y rotation side)
C201  14.61,20.32 180 bottom
C202  14.61,17.78 180 bottom
C203  19.68,17.78 0 bottom
C204  19.68,20.32 0 bottom
C205  49.53,31.11 180 bottom
C206  54.61,39.37 270 bottom
C301  16.51,92.08 180 top
C302  16.51,87 180 top
C401  16.51,66.67 180 top
C402  16.51,61.59 180 top
C501  16.51,41.27 180 top
C502  16.51,36.2 180 top
HI301  8.89,102.87 0 top
HI302  Direction & Dead Time  [19.06.15_H']  52.07,115.57 0 top
HI401  8.89,77.47 0 top
HI402  Direction & Dead Time  [19.06.15_H']  52.07,90.17 0 top
HI501  8.89,52.07 0 top
HI502  Direction & Dead Time  [19.06.15_H']  52.07,64.77 0 top
IC201  17.14,16.51 0 top
IC202  49.53,39.37 0 bottom
JP101  49.53,10.16 180 top
JP501  74.93,45.72 0 top
R101  13.97,127.64 270 top
R102  8.89,127.64 270 top
R103  41.27,127.64 270 top
R104  69.85,127.64 90 top
R105  43.81,127.64 270 top
R106  67.31,127.64 90 top
R107  64.77,127.64 90 top
R108  62.23,127.64 90 top
R109  59.69,127.64 90 top
R110  57.15,127.64 90 top
R301  25.4,95.89 90 top
R302  12.7,107.31 180 top
R303  22.86,107.31 180 bottom
R304  25.4,89.53 0 top
R305  25.4,92.08 180 top
R306  25.4,99.69 180 top
R307  6.35,84.45 270 top
R308  6.35,92.08 270 top
R309  25.4,84.45 0 bottom
R310  25.4,87 180 top
R311  10.16,97.16 180 top
R401  25.4,70.48 90 top
R402  12.7,81.92 180 top
R403  25.4,81.92 0 top
R404  25.4,64.14 0 top
R405  25.4,66.67 180 top
R406  25.4,74.3 180 top
R407  6.35,59.05 270 top
R408  6.35,66.67 270 top
R409  25.4,59.05 180 top
R410  25.4,61.59 180 top
R411  10.16,71.75 180 top
R501  25.4,45.09 90 top
R502  12.7,56.52 180 top
R503  25.4,56.52 0 top
R504  25.4,38.73 0 top
R505  25.4,41.27 180 top
R506  25.4,48.9 180 top
R507  6.35,33.66 270 top
R508  6.35,41.27 270 top
R509  25.4,33.66 180 top
R510  25.4,36.2 180 top
R511  10.16,46.35 180 top
R512  66.04,37.47 0 top
SV101  69.85,139.06 180 top
SV102  52.07,19.68 180 top

### Tracks (layer width: path | path; a pad name or v marks a point on that pad's centre or on a via)
!CURRENT_SP_U  (via drill 0.5 pad 2.18)
  Bottom 0.813: HI301.10 42.55,104.78 36.2,104.78 | 36.2,104.78 24.77,104.78 24.13,104.14 HI301.7 24.13,95.89 | 36.2,104.78 v36.2,115.57 | R301.3 24.13,95.89 | 24.13,95.89 R301.2
  other vias: 44.45,102.87 24.13,102.87 22.86,95.89 25.4,95.89
!CURRENT_SP_V  (via drill 0.5 pad 2.18)
  Bottom 0.813: 24.13,70.48 HI401.7 24.13,78.74 24.77,79.38 36.83,79.38 | 36.83,79.38 42.55,79.38 HI401.10 | 36.83,79.38 v36.83,90.17 | R401.3 24.13,70.48 | 24.13,70.48 R401.2
  other vias: 44.45,77.47 24.13,77.47 22.86,70.48 25.4,70.48
!CURRENT_SP_W  (via drill 0.5 pad 2.18)
  Bottom 0.813: HI501.10 42.55,53.98 36.83,53.98 | 24.13,45.09 HI501.7 24.13,53.34 24.77,53.98 36.83,53.98 | 36.83,53.98 v36.83,64.77 | R501.3 24.13,45.09 | 24.13,45.09 R501.2
  other vias: 44.45,52.07 24.13,52.07 22.86,45.09 25.4,45.09
+3V3  (via drill 0.5 pad 2.18)
  Top 1.27: v25.4,13.97 25.4,21.59 27.94,24.13 44.45,24.13 46.99,26.67 46.99,33.66 v43.81,36.83
  Bottom 0.813: IC201.3 21.09,15.37 C203.1 C204.1
  Bottom 1.27: HI302.4 v59.69,109.22 HI301.16 HI402.4 HI401.16 HI502.4 HI501.16 59.69,48.9 | JP101.2 49.53,8.89 48.26,7.62 31.75,7.62 v25.4,13.97 IC201.3
  other vias: 59.69,52.07 59.69,64.77 59.69,77.47 59.69,90.17 59.69,115.57 59.69,102.87 49.53,10.16 19.68,13.97
  pour Bottom (isolate 0.813, no thermals): 35.56,26.67 35.56,49.53 60.33,49.53 60.33,26.67
+5V_MCU_BOARD  (via drill 0.5 pad 2.18)
  Bottom 1.27: JP101.1 SV102.18 SV102.20
  other vias: 49.53,18.41 52.07,18.41 52.07,10.16
+12V  (via drill 0.5 pad 2.18)
  Bottom 0.813: 8.89,80.64 R307.2 | v6.35,29.84 11.43,29.84 | 8.89,55.24 R407.2
  Bottom 1.27: R102.2 v8.89,115.57 R302.2 HI301.1 8.89,95.89 11.43,93.34 11.43,87.63 8.89,85.09 R402.2 8.89,80.64 HI401.1 8.89,70.48 11.43,67.94 11.43,62.23 8.89,59.69 R502.2 8.89,55.24 HI501.1 8.89,45.72 11.43,43.18 11.43,29.84 18.41,22.86 29.84,22.86 SV102.33 | SV102.33 31.75,19.68 | SV102.33 SV102.34
  other vias: 8.89,102.87 8.89,77.47 8.89,52.07 8.89,56.52 8.89,81.92 8.89,107.31 8.89,123.83 31.75,20.95 31.75,18.41 6.35,80.64 6.35,55.24
+12V_OR_+5V  (via drill 0.5 pad 2.18)
  Top 1.27: v72.39,131.44 74.93,133.99 91.44,133.99 95.25,130.18 95.25,27.3 75.56,7.62 48.26,7.62 46.99,8.89 JP101.3 v44.45,10.16 v14.61,10.16
  Bottom 0.813: 47.22,31.11 C205.1 | IC201.1 13.21,15.37 C202.1 C201.1
  Bottom 1.27: SV101.15 SV101.16 v72.39,131.44 | IC202.3 47.22,31.11 47.22,28.8 46.99,28.57 SV102.21 SV102.22 JP101.3 v44.45,10.16 | v14.61,10.16 IC201.1
  other vias: 72.39,140.34 72.39,137.79 46.99,20.95 46.99,18.41 46.99,10.16 14.61,13.97
+15V  (via drill 0.5 pad 2.18)
  Bottom 0.813: SV101.9 80.01,141.6 73.66,147.96 25.4,147.96 R102.1
  Bottom 1.27: SV101.9 SV101.10
  other vias: 8.89,131.44 80.01,140.34 80.01,137.79
-12V  (via drill 0.5 pad 2.18)
  Bottom 1.27: R101.2 v13.97,115.57 HI301.3 R311.1 16.51,94.61 16.51,86.36 13.97,83.82 HI401.3 R411.1 16.51,69.22 16.51,60.96 13.97,58.42 HI501.3 R511.1 16.51,43.81 16.51,34.92 20.95,30.48 33.66,30.48 36.83,27.3 SV102.29 SV102.30
  other vias: 13.97,102.87 13.97,77.47 13.97,52.07 13.97,123.83 36.83,18.41 36.83,20.95 13.97,97.16 13.97,71.75 13.97,46.35
-15V  (via drill 0.5 pad 2.18)
  Bottom 0.813: SV101.7 82.55,141.6 74.93,149.22 23.5,149.22 6.99,132.72 6.99,130.18 7.62,129.54 12.06,129.54 R101.1
  Bottom 1.27: SV101.7 SV101.8
  other vias: 13.97,131.44 82.55,140.34 82.55,137.79
AGND  (via drill 0.5 pad 2.18)
  Top 1.27: v11.43,99.69 v19.05,99.69 | v11.43,74.3 v19.05,74.3 | v11.43,48.9 v19.05,48.9
  Bottom 0.813: HI301.6 R306.2 | HI401.6 R406.2 | HI501.6 R506.2
  Bottom 1.27: HI401.6 HI401.5 v19.05,74.3 | v19.05,99.69 HI301.5 HI301.6 21.59,127.64 12.7,127.64 11.43,126.36 v11.43,123.83 v11.43,115.57 HI301.2 v11.43,99.69 11.43,96.52 13.97,93.98 C301.2 C302.2 11.43,84.45 HI401.2 v11.43,74.3 11.43,71.12 13.97,68.58 C401.2 C402.2 11.43,59.05 HI501.2 v11.43,48.9 11.43,45.72 13.97,43.18 C501.2 C502.2 13.97,32.38 19.68,26.67 29.84,26.67 34.29,22.23 SV102.31 SV102.32 | HI501.6 HI501.5 v19.05,48.9
  Bottom 1.422: SV101.12 SV101.11 77.47,141.6 73.03,146.05 40.01,146.05 21.59,127.64
  other vias: 11.43,102.87 11.43,77.47 11.43,52.07 21.59,52.07 21.59,77.47 21.59,102.87 19.05,102.87 19.05,77.47 19.05,52.07 21.59,99.69 13.97,92.08 13.97,87 21.59,48.9 13.97,36.2 13.97,41.27 21.59,74.3 13.97,66.67 13.97,61.59 34.29,20.95 34.29,18.41 77.47,140.34 77.47,137.79
BR_RESISTOR  (via drill 0.5 pad 2.18)
  Top 0.813: R105.2 40.01,120.02 40.01,53.34 52.07,41.27 v52.07,27.94
  Bottom 0.813: SV102.17 v52.07,27.94
  other vias: 52.07,20.95 43.81,123.83
CHARGE_RELAY  (via drill 0.5 pad 2.18)
  Top 0.813: v49.53,27.94 49.53,41.91 38.73,52.7 38.73,121.28 R103.2
  Bottom 0.813: SV102.19 v49.53,27.94
  other vias: 49.53,20.95 41.27,123.83
CURRENT_A  (via drill 0.5 pad 2.18)
  Top 0.813: R303.2 29.84,110.49 29.84,137.79 41.27,149.22 90.17,149.22 92.08,147.32 92.08,146.05 92.08,143.51 91.44,142.88 85.72,142.88 85.09,143.51 v85.09,144.78
  Bottom 0.813: v85.09,144.78 SV101.5
  other vias: 85.09,140.34 26.67,107.31
CURRENT_B  (via drill 0.5 pad 2.18)
  Top 0.813: v31.75,97.16 33.66,99.06 33.66,137.79 42.55,146.69 86.36,146.69 87.63,145.41 v87.63,144.78
  Bottom 0.813: R403.2 31.75,84.45 v31.75,97.16 | v87.63,144.78 SV101.3
  other vias: 87.63,140.34 29.21,81.92
CURRENT_C  (via drill 0.5 pad 2.18)
  Top 0.813: v31.75,66.67 v31.75,81.92 | v31.75,99.69 31.75,137.79 41.91,147.96 88.27,147.96 90.17,146.05 v90.17,144.78
  Bottom 0.813: R503.2 31.75,59.05 v31.75,66.67 | v31.75,81.92 33.66,83.82 33.66,97.79 v31.75,99.69 | v90.17,144.78 SV101.1
  other vias: 90.17,140.34 29.21,56.52
CURRENT_FB_U  (via drill 0.5 pad 2.18)
  Bottom 0.813: R302.1 R303.1
  Bottom 1.27: HI301.4 R302.1
  other vias: 19.05,107.31 16.51,107.31 19.05,107.31 16.51,102.87
CURRENT_FB_V  (via drill 0.5 pad 2.18)
  Bottom 0.813: R402.1 R403.1
  Bottom 1.27: HI401.4 R402.1
  other vias: 21.59,81.92 16.51,81.92 21.59,81.92 16.51,77.47
CURRENT_FB_W  (via drill 0.5 pad 2.18)
  Bottom 0.813: HI501.4 R502.1 R503.1
  other vias: 21.59,56.52 16.51,56.52 21.59,56.52 16.51,52.07
CURRENT_MOTOR  (via drill 0.5 pad 2.18)
  Top 0.813: v39.37,13.97 39.37,12.7 40.01,12.06 43.18,12.06 43.81,12.7 78.11,12.7 93.34,27.94 93.34,128.27 v90.17,131.44
  Bottom 0.813: v39.37,13.97 SV102.28 | v90.17,131.44 SV101.2
  other vias: 39.37,18.41 90.17,137.79
ENABLE  (via drill 0.5 pad 2.18)
  Top 0.813: v64.77,45.72 v69.85,45.72
  Bottom 0.813: SV102.15 54.61,23.5 64.77,33.66 v64.77,45.72 HI501.18 HI502.6 HI401.18 HI402.6 HI301.18 HI302.6 | v69.85,45.72 JP501.1
  other vias: 64.77,64.77 64.77,90.17 64.77,115.57 54.61,20.95 64.77,52.07 64.77,77.47 64.77,102.87 72.39,45.72
GND  (via drill 0.5 pad 2.18)
  Top 1.27: v78.74,18.41 78.74,31.75 76.2,34.29 65.41,34.29 R512.1
  Bottom 0.813: SV102.16 SV102.14 SV102.12 SV102.10 SV102.8 SV102.6 SV102.4 SV102.2 | 54.61,36.27 C206.2 | IC202.1 51.84,32.03 C205.2 | 17.14,17.78 C202.2 | 17.14,17.78 C203.2 | IC201.2 17.14,17.78 | 17.14,20.32 C201.2 | 17.14,20.32 C204.2 | 17.14,17.78 17.14,20.32
  Bottom 1.27: SV101.13 SV101.14 74.93,124.46 68.58,118.11 63.5,118.11 62.23,116.84 HI302.5 v62.23,109.22 HI301.17 HI402.5 HI401.17 HI502.5 HI501.17 R512.1 61.04,36.27 54.61,36.27 IC202.1 | SV102.2 v78.74,18.41 66.04,5.71 21.59,5.71 17.14,10.16 IC201.2
  other vias: 62.23,52.07 62.23,64.77 62.23,77.47 62.23,90.17 62.23,115.57 62.23,102.87 62.23,37.47 74.93,140.34 74.93,137.79 54.61,18.41 57.15,18.41 72.39,18.41 64.77,18.41 62.23,18.41 59.69,18.41 67.31,18.41 69.85,18.41 62.23,37.47 17.14,13.97
  pour Top (isolate 0.61, no thermals): 6.35,9.53 6.35,33.66 29.21,33.66 29.21,9.53
N$1  (via drill 0.5 pad 3.3)
  other vias: 5,155
N$3  (via drill 0.5 pad 3.3)
  other vias: 95,155
N$4  (via drill 0.5 pad 3.3)
  other vias: 5,5
N$5  (via drill 0.5 pad 3.3)
  other vias: 95,5
N$6  (via drill 0.5 pad 2.18)
  other vias: 52.07,90.17
N$7  (via drill 0.5 pad 2.18)
  other vias: 52.07,64.77
N$8  (via drill 0.5 pad 2.18)
  Bottom 0.813: SV101.19 67.31,141.6 66.04,142.88 45.09,142.88 43.81,141.6 R105.1
  other vias: 43.81,131.44 67.31,140.34
N$9  (via drill 0.5 pad 2.18)
  other vias: 44.45,18.41
N$10
  Top 0.813: 2.5,154.5 2.5,157.5 5.5,157.5
N$11  (via drill 0.5 pad 2.18)
  other vias: 49.53,140.34
N$12  (via drill 0.5 pad 2.18)
  other vias: 52.07,115.57
N$13  (via drill 0.5 pad 2.18)
  other vias: 54.61,115.57
N$14  (via drill 0.5 pad 2.18)
  other vias: 52.07,140.34
N$15  (via drill 0.5 pad 2.18)
  other vias: 54.61,140.34
N$16  (via drill 0.5 pad 2.18)
  other vias: 57.15,140.34
N$17  (via drill 0.5 pad 2.18)
  other vias: 59.69,140.34
N$18  (via drill 0.5 pad 2.18)
  other vias: 57.15,115.57
N$19  (via drill 0.5 pad 2.18)
  other vias: 54.61,90.17
N$20  (via drill 0.5 pad 2.18)
  other vias: 57.15,90.17
N$21  (via drill 0.5 pad 2.18)
  other vias: 62.23,140.34
N$22  (via drill 0.5 pad 2.18)
  other vias: 64.77,140.34
N$23  (via drill 0.5 pad 2.18)
  other vias: 54.61,137.79
N$24  (via drill 0.5 pad 2.18)
  other vias: 54.61,64.77
N$25  (via drill 0.5 pad 2.18)
  other vias: 52.07,137.79
N$26  (via drill 0.5 pad 2.18)
  other vias: 49.53,137.79
N$28  (via drill 0.5 pad 2.18)
  other vias: 57.15,64.77
N$29  (via drill 0.5 pad 2.18)
  other vias: 87.63,137.79
N$30
  Top 0.813: 94.5,157.5 97.5,157.5 97.5,154.5
N$31  (via drill 0.5 pad 3.3)
  other vias: 92.5,7.5
N$32  (via drill 0.5 pad 3.3)
  other vias: 7.5,7.5
N$33  (via drill 0.5 pad 2.18)
  other vias: 46.99,52.07
N$34  (via drill 0.5 pad 3.3)
  other vias: 7.5,152.5
N$35  (via drill 0.5 pad 2.18)
  other vias: 49.53,52.07
N$36  (via drill 0.5 pad 3.3)
  other vias: 92.5,152.5
N$37
  Top 0.813: 2.5,5.5 2.5,2.5 5.5,2.5
N$38
  Top 0.813: 94.5,2.5 97.5,2.5 97.5,5.5
N$39
  Bottom 0.813: 94.5,2.5 97.5,2.5 97.5,5.5
N$40
  Bottom 0.813: 5.5,2.5 2.5,2.5 2.5,5.5
N$41  (via drill 0.5 pad 2.18)
  Bottom 0.813: SV101.17 69.85,141.6 67.31,144.15 43.81,144.15 41.27,141.6 R103.1
  other vias: 41.27,131.44 69.85,140.34
N$42  (via drill 0.5 pad 2.18)
  other vias: 52.07,52.07
N$43  (via drill 0.5 pad 2.18)
  other vias: 54.61,52.07
N$44  (via drill 0.5 pad 2.18)
  other vias: 57.15,52.07
N$45  (via drill 0.5 pad 2.18)
  other vias: 46.99,77.47
N$46  (via drill 0.5 pad 2.18)
  other vias: 49.53,77.47
N$47  (via drill 0.5 pad 2.18)
  other vias: 52.07,77.47
N$48  (via drill 0.5 pad 2.18)
  other vias: 54.61,77.47
N$49  (via drill 0.5 pad 2.18)
  other vias: 57.15,77.47
N$50  (via drill 0.5 pad 2.18)
  other vias: 46.99,102.87
N$51  (via drill 0.5 pad 2.18)
  other vias: 49.53,102.87
N$52  (via drill 0.5 pad 2.18)
  other vias: 52.07,102.87
N$53  (via drill 0.5 pad 2.18)
  other vias: 54.61,102.87
N$54  (via drill 0.5 pad 2.18)
  other vias: 57.15,102.87
N$55  (via drill 0.5 pad 2.18)
  Bottom 0.813: R310.1 27.3,88.9 27.3,90.17 R305.1 29.21,94.61 R301.1 26.67,97.16 HI301.8
  other vias: 29.21,92.08 29.21,87 26.67,102.87 27.94,95.89
N$56  (via drill 0.5 pad 2.18)
  Bottom 0.813: C301.1 R305.2 R304.1
  other vias: 21.59,89.53 21.59,92.08 19.05,92.08
N$57  (via drill 0.5 pad 2.18)
  Bottom 1.27: R306.1 HI301.9
  other vias: 29.21,99.69 29.21,102.87
N$58  (via drill 0.5 pad 2.18)
  Bottom 0.813: R309.1 26.67,84.45 24.13,87 R310.2 C302.1
  other vias: 29.21,84.45 21.59,87 19.05,87
N$59  (via drill 0.5 pad 2.18)
  Top 0.813: v3.81,84.45 R309.2
  Bottom 0.813: v3.81,84.45 3.81,89.53 R308.2
  other vias: 6.35,92.08 21.59,84.45
N$60  (via drill 0.5 pad 2.18)
  Bottom 0.813: R308.3 8.89,90.81 R307.1
  other vias: 8.89,92.08 6.35,88.27
N$61  (via drill 0.5 pad 2.18)
  Bottom 0.813: R311.2 3.81,94.61 R308.1
  other vias: 3.81,92.08 6.35,97.16
N$62  (via drill 0.5 pad 2.18)
  Bottom 0.813: HI401.8 26.67,71.75 R401.1 29.21,69.22 R405.1 27.3,64.77 27.3,63.5 R410.1
  other vias: 26.67,77.47 29.21,66.67 29.21,61.59 27.94,70.48
N$63  (via drill 0.5 pad 2.18)
  Bottom 0.813: R404.1 R405.2 C401.1
  other vias: 19.05,66.67 21.59,66.67 21.59,64.14
N$64  (via drill 0.5 pad 2.18)
  Bottom 0.813: R406.1 HI401.9
  other vias: 29.21,77.47 29.21,74.3
N$65  (via drill 0.5 pad 2.18)
  Bottom 0.813: R409.1 26.67,59.05 24.13,61.59 R410.2 C402.1
  other vias: 21.59,61.59 29.21,59.05 19.05,61.59
N$66  (via drill 0.5 pad 2.18)
  Top 0.813: v3.81,59.05 R409.2
  Bottom 0.813: v3.81,59.05 3.81,64.14 R408.2
  other vias: 6.35,66.67 21.59,59.05
N$67  (via drill 0.5 pad 2.18)
  Bottom 0.813: R408.3 6.35,64.14 R407.1
  other vias: 6.35,62.87 8.89,66.67
N$68  (via drill 0.5 pad 2.18)
  Bottom 0.813: R408.1 3.81,69.22 R411.2
  other vias: 3.81,66.67 6.35,71.75
N$69  (via drill 0.5 pad 2.18)
  Bottom 0.813: R510.1 27.3,38.1 27.3,39.37 R505.1 29.21,43.81 R501.1 26.67,46.35 HI501.8
  other vias: 26.67,52.07 29.21,41.27 29.21,36.2 27.94,45.09
N$70  (via drill 0.5 pad 2.18)
  Bottom 0.813: R504.1 R505.2 C501.1
  other vias: 21.59,41.27 21.59,38.73 19.05,41.27
N$71  (via drill 0.5 pad 2.18)
  Bottom 0.813: R506.1 HI501.9
  other vias: 29.21,52.07 29.21,48.9
N$72  (via drill 0.5 pad 2.18)
  Bottom 0.813: R509.1 26.67,33.66 24.13,36.2 R510.2 C502.1
  other vias: 21.59,36.2 29.21,33.66 19.05,36.2
N$73  (via drill 0.5 pad 2.18)
  Top 0.813: v3.81,33.66 R509.2
  Bottom 0.813: v3.81,33.66 3.81,38.73 R508.2
  other vias: 6.35,41.27 21.59,33.66
N$74  (via drill 0.5 pad 2.18)
  Bottom 0.813: R508.3 6.35,38.73 R507.1
  other vias: 8.89,41.27 6.35,37.47
N$75  (via drill 0.5 pad 2.18)
  Bottom 0.813: R508.1 3.81,43.81 R511.2
  other vias: 6.35,46.35 3.81,41.27
N$76
  Bottom 0.813: 2.5,154.5 2.5,157.5 5.5,157.5
N$77
  Bottom 0.813: 94.5,157.5 97.5,157.5 97.5,154.5
N$78  (via drill 0.5 pad 3.3)
  other vias: 15,155
N$79  (via drill 0.5 pad 3.3)
  other vias: 85,155
N$80  (via drill 0.5 pad 3.3)
  other vias: 15,5
N$81  (via drill 0.5 pad 3.3)
  other vias: 85,5
OSC  (via drill 0.5 pad 2.18)
  Bottom 0.813: HI302.7 HI301.19 HI402.7 HI401.19 HI502.7 HI501.19 67.31,43.18 | SV102.13 57.15,23.5 67.31,33.66 67.31,43.18 | JP501.3 77.47,44.45 76.2,43.18 67.31,43.18
  other vias: 67.31,52.07 67.31,64.77 67.31,77.47 67.31,90.17 67.31,115.57 67.31,102.87 57.15,20.95 77.47,45.72
OSC_OR_ENABLE  (via drill 0.5 pad 2.18)
  Top 0.813: v81.28,57.15 81.28,71.12 v77.47,74.93 | v77.47,100.33 81.28,96.52 v81.28,82.55
  Bottom 0.813: HI501.21 72.39,50.16 73.03,49.53 74.93,49.53 | 74.93,49.53 76.83,49.53 77.47,50.16 | 77.47,50.16 HI501.23 77.47,53.34 v81.28,57.15 | HI401.21 72.39,76.2 73.66,74.93 v77.47,74.93 HI401.23 77.47,78.74 v81.28,82.55 | HI301.21 72.39,101.6 73.66,100.33 v77.47,100.33 HI301.23 | 74.93,49.53 JP501.2 | R512.2 73.03,40.64 76.83,40.64 80.01,43.81 80.01,47.62 77.47,50.16
  other vias: 72.39,52.07 77.47,52.07 72.39,77.47 77.47,77.47 72.39,102.87 77.47,102.87 74.93,45.72 69.85,37.47
PWM1_H  (via drill 0.5 pad 2.18)
  Bottom 0.813: R104.2 SV101.18
  other vias: 69.85,137.79 69.85,131.44
PWM1_L  (via drill 0.5 pad 2.18)
  Bottom 0.813: R108.2 SV101.24
  other vias: 62.23,137.79 62.23,131.44
PWM2_H  (via drill 0.5 pad 2.18)
  Bottom 0.813: R106.2 SV101.20
  other vias: 67.31,137.79 67.31,131.44
PWM2_L  (via drill 0.5 pad 2.18)
  Bottom 0.813: R109.2 SV101.26
  other vias: 59.69,137.79 59.69,131.44
PWM3_H  (via drill 0.5 pad 2.18)
  Bottom 0.813: R107.2 SV101.22
  other vias: 64.77,137.79 64.77,131.44
PWM3_L  (via drill 0.5 pad 2.18)
  Bottom 0.813: R110.2 SV101.28
  other vias: 57.15,137.79 57.15,131.44
SP_CURRENT_U  (via drill 0.5 pad 2.18)
  Top 0.813: v44.45,27.94 44.45,30.48 33.66,41.27 33.66,85.09 R304.2
  Bottom 0.813: SV102.23 v44.45,27.94
  other vias: 29.21,89.53 44.45,20.95
SP_CURRENT_V  (via drill 0.5 pad 2.18)
  Top 0.813: v41.91,27.94 41.91,30.48 31.75,40.64 31.75,61.59 R404.2
  Bottom 0.813: SV102.25 v41.91,27.94
  other vias: 29.21,64.14 41.91,20.95
SP_CURRENT_W  (via drill 0.5 pad 2.18)
  Top 0.813: v39.37,27.94 39.37,29.84 39.37,30.48 31.11,38.73 R504.2
  Bottom 0.813: SV102.27 v39.37,27.94
  other vias: 29.21,38.73 39.37,20.95
U_DIRECTION  (via drill 0.5 pad 2.18)
  Bottom 0.813: HI302.9 72.39,116.84 73.66,118.11 92.08,118.11 95.25,114.94 95.25,37.47 90.17,32.38 78.74,32.38 69.85,23.5 SV102.3
  other vias: 72.39,115.57 69.85,20.95
U_ENABLE  (via drill 0.5 pad 2.18)
  Bottom 0.813: SV102.1 72.39,23.5 80.01,31.11 90.81,31.11 96.52,36.83 96.52,115.57 92.71,119.38 72.39,119.38 69.85,116.84 HI302.8
  other vias: 69.85,115.57 72.39,20.95
U_ENABLE_G1  (via drill 0.5 pad 2.18)
  Bottom 0.813: HI302.10 74.93,109.22 69.85,104.14 HI301.20
  other vias: 74.93,115.57 69.85,102.87
U_ENABLE_G2  (via drill 0.5 pad 2.18)
  Bottom 0.813: HI301.22 74.93,104.14 77.47,106.68 HI302.11
  other vias: 77.47,115.57 74.93,102.87
U_G1  (via drill 0.5 pad 2.18)
  Top 0.813: R104.1 69.85,121.92 66.04,118.11 45.72,118.11 43.81,116.2 43.81,106.68 45.09,105.41 v81.28,105.41
  Bottom 0.813: v81.28,105.41 81.28,102.87
  Bottom 1.27: HI301.24 81.28,102.87 HI301.25
  other vias: 80.01,102.87 82.55,102.87 69.85,123.83
U_G2  (via drill 0.5 pad 2.18)
  Top 0.813: R108.1 62.23,125.09 63.5,126.36 84.45,126.36 86.36,124.46 v86.36,105.41
  Bottom 1.27: 86.36,102.87 HI301.26 | 86.36,102.87 HI301.27 | v86.36,105.41 86.36,102.87
  other vias: 85.09,102.87 87.63,102.87 62.23,123.83
V_DIRECTION  (via drill 0.5 pad 2.18)
  Bottom 0.813: HI402.9 72.39,93.34 73.03,93.98 90.17,93.98 92.71,91.44 92.71,38.73 88.9,34.92 76.2,34.92 64.77,23.5 SV102.7
  other vias: 72.39,90.17 64.77,20.95
V_ENABLE  (via drill 0.5 pad 2.18)
  Bottom 0.813: HI402.8 69.85,93.98 71.12,95.25 91.44,95.25 93.98,92.71 93.98,38.1 89.53,33.66 77.47,33.66 67.31,23.5 SV102.5
  other vias: 69.85,90.17 67.31,20.95
V_ENABLE_G3  (via drill 0.5 pad 2.18)
  Bottom 0.813: HI401.20 69.85,78.74 74.93,83.82 HI402.10
  other vias: 69.85,77.47 74.93,90.17
V_ENABLE_G4  (via drill 0.5 pad 2.18)
  Bottom 0.813: HI401.22 74.93,78.74 77.47,81.28 HI402.11
  other vias: 74.93,77.47 77.47,90.17
V_G3  (via drill 0.5 pad 2.18)
  Top 0.813: v81.28,80.01 45.09,80.01 42.55,82.55 42.55,117.47 44.45,119.38 64.77,119.38 67.31,121.92 R106.1
  Bottom 0.813: v81.28,80.01 81.28,77.47
  Bottom 1.27: HI401.24 81.28,77.47 HI401.25
  other vias: 80.01,77.47 82.55,77.47 67.31,123.83
V_G4  (via drill 0.5 pad 2.18)
  Top 0.813: v86.36,80.01 89.53,83.19 89.53,123.19 85.09,127.64 62.23,127.64 59.69,125.09 R109.1
  Bottom 1.27: HI401.26 86.36,77.47 | 86.36,77.47 HI401.27 | 86.36,77.47 v86.36,80.01
  other vias: 85.09,77.47 87.63,77.47 59.69,123.83
VBUS  (via drill 0.5 pad 2.18)
  Top 0.813: v41.91,13.97 77.47,13.97 92.08,28.57 92.08,124.46 v85.09,131.44
  Bottom 0.813: v41.91,13.97 SV102.26 | v85.09,131.44 SV101.6
  other vias: 41.91,18.41 85.09,137.79
W_DIRECTION  (via drill 0.5 pad 2.18)
  Bottom 0.813: HI502.9 72.39,68.58 73.66,69.85 87,69.85 90.17,66.67 90.17,40.01 87.63,37.47 73.66,37.47 59.69,23.5 SV102.11
  other vias: 72.39,64.77 59.69,20.95
W_ENABLE  (via drill 0.5 pad 2.18)
  Bottom 0.813: HI502.8 69.85,69.85 71.75,71.75 88.9,71.75 91.44,69.22 91.44,39.37 88.27,36.2 74.93,36.2 62.23,23.5 SV102.9
  other vias: 69.85,64.77 62.23,20.95
W_ENABLE_G5  (via drill 0.5 pad 2.18)
  Bottom 0.813: HI501.20 69.85,53.34 74.93,58.42 HI502.10
  other vias: 69.85,52.07 74.93,64.77
W_ENABLE_G6  (via drill 0.5 pad 2.18)
  Bottom 0.813: HI501.22 74.93,53.34 77.47,55.88 HI502.11
  other vias: 77.47,64.77 74.93,52.07
W_G5  (via drill 0.5 pad 2.18)
  Top 0.813: v81.28,54.61 45.09,54.61 41.27,58.42 41.27,118.75 43.18,120.65 62.87,120.65 64.77,122.56 R107.1
  Bottom 0.813: v81.28,54.61 81.28,52.07
  Bottom 1.27: HI501.24 81.28,52.07 HI501.25
  other vias: 82.55,52.07 80.01,52.07 64.77,123.83
W_G6  (via drill 0.5 pad 2.18)
  Top 0.813: v86.36,54.61 90.81,60.33 90.81,123.83 85.72,128.91 60.96,128.91 57.15,125.09 R110.1
  Bottom 1.27: HI501.26 86.36,52.07 | 86.36,52.07 HI501.27 | 86.36,52.07 v86.36,54.61
  other vias: 85.09,52.07 87.63,52.07 57.15,123.83

### Text on the board
Reference: +12V 0V -12V | +5V 0V
tDocu: ENABLE | OSC | W_DIRECTION | W_ENABLE | V_DIRECTION | V_ENABLE | U_DIRECTION | U_ENABLE